# EAGLE design SmartTeaMachinePCB (EAGLE 9.6.2)
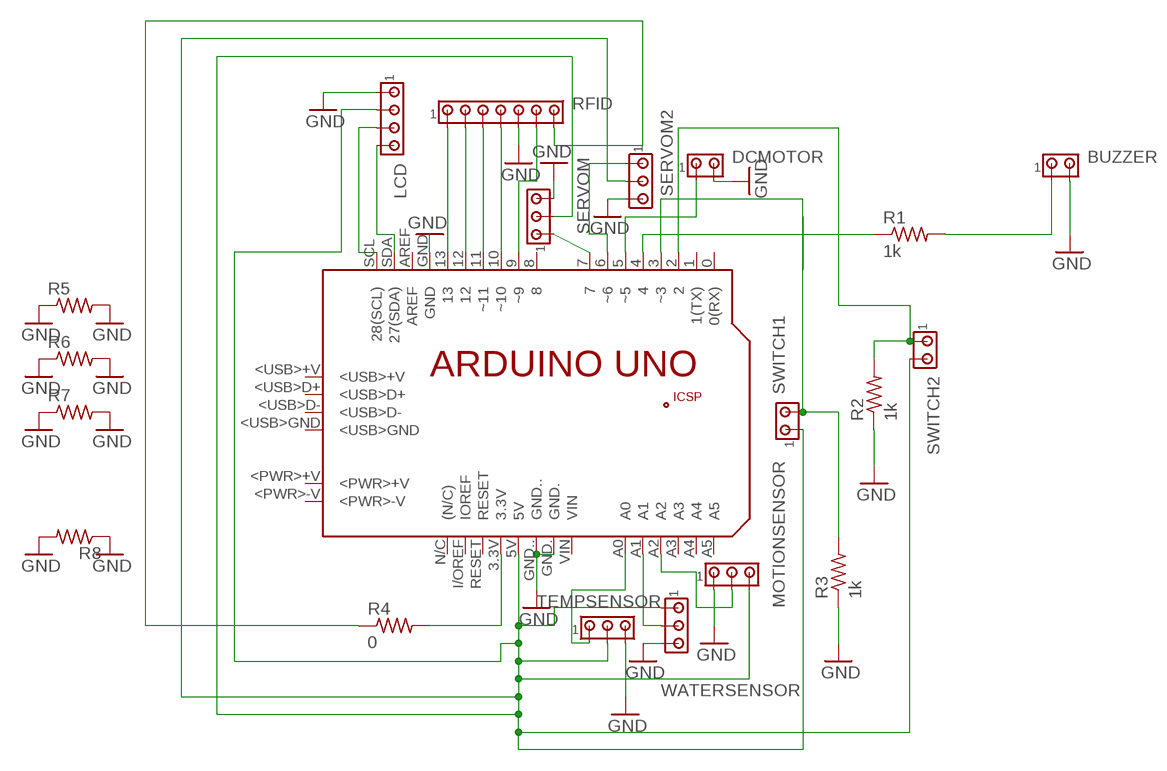
[diagram p0: schematic, sheet 1]

## Parts
BUZZER  MTA02-100  [10X02MTA]
DCMOTOR  MTA02-100  [10X02MTA]
LCD  MTA04-100  [10X04MTA]
MOTIONSENSOR  MTA03-100  [10X03MTA]
PCB1  ARDUINO_UNO  [ARDUINO_UNO]
R1  1k  R-US_0207/10  [0207/10]
R2  1k  R-US_0207/10  [0207/10]
R3  1k  R-US_0207/10  [0207/10]
R4  0  R-US_0207/10  [0207/10]
R5  R-US_0207/10  [0207/10]
R6  R-US_0207/10  [0207/10]
R7  R-US_0207/10  [0207/10]
R8  R-US_0207/10  [0207/10]
RFID  MTA07-100  [10X07MTA]
SERVOM  MTA03-100  [10X03MTA]
SERVOM2  MTA03-100  [10X03MTA]
SWITCH1  MTA02-100  [10X02MTA]
SWITCH2  MTA02-100  [10X02MTA]
TEMPSENSOR  MTA03-100  [10X03MTA]
WATERSENSOR  MTA03-100  [10X03MTA]

## Nets
GND: BUZZER.2 DCMOTOR.2 LCD.1 MOTIONSENSOR.1 PCB1.GND PCB1.GND. PCB1.GND.. R2.1 R3.1 R5.1 R5.2 R6.1 R6.2 R7.1 R7.2 R8.1 R8.2 RFID.5 SERVOM2.3 SERVOM.3 TEMPSENSOR.3 WATERSENSOR.3
N$1: PCB1.7 SERVOM.1
N$2: PCB1.6(~6) SERVOM2.1
N$3: PCB1.A1 WATERSENSOR.2
N$4: PCB1.A0 TEMPSENSOR.1
N$5: LCD.2 MOTIONSENSOR.3 PCB1.5V SERVOM2.2 SERVOM.2 SWITCH1.1 SWITCH2.2 TEMPSENSOR.2 WATERSENSOR.1
N$6: LCD.3 PCB1.SCL(28(SCL))
N$7: LCD.4 PCB1.SDA(27(SDA))
N$8: PCB1.13 RFID.1
N$9: PCB1.12 RFID.2
N$10: MOTIONSENSOR.2 PCB1.A2
N$11: PCB1.11(~11) RFID.3
N$12: PCB1.10(~10) RFID.4
N$13: PCB1.9(~9) RFID.6
N$14: R4.1 RFID.7
N$15: DCMOTOR.1 PCB1.5(~5)
N$16: PCB1.4 R1.1
N$17: BUZZER.1 R1.2
N$18: PCB1.2 R2.2 SWITCH2.1
N$19: PCB1.3.3V R4.2
N$23: PCB1.3(~3) R3.2 SWITCH1.2
Unconnected: PCB1.0(0(RX)) PCB1.1(1(TX)) PCB1.8 PCB1.+5V PCB1.<PWR>+V PCB1.<PWR>-V PCB1.<USB>+V PCB1.<USB>D+ PCB1.<USB>D- PCB1.<USB>GND PCB1.A3 PCB1.A4 PCB1.A5 PCB1.AREF PCB1.GND_ PCB1.I/OREF(IOREF) PCB1.MISO PCB1.MOSI PCB1.N/C((N/C)) PCB1.RESET PCB1.RESET. PCB1.SCK PCB1.VIN

## Library data of the parts
BUZZER DCMOTOR SWITCH1 SWITCH2 = con-amp:MTA02-100: AMP connector
LCD = con-amp:MTA04-100: AMP connector
MOTIONSENSOR SERVOM SERVOM2 TEMPSENSOR WATERSENSOR = con-amp:MTA03-100: AMP connector
PCB1 = Arduino_Shield (1):ARDUINO_UNO: Device for representing an Arduino Uno board with a footprint in an EAGLE design. Created by Dave Young for Element14. More EAGLE documentation at: http://www.element14.com/community/community/knode/cadsoft_eagle
R1-R8 = rcl:R-US_: RESISTOR, American symbol; SPICEPREFIX: R
RFID = con-amp:MTA07-100: AMP connector

## Board
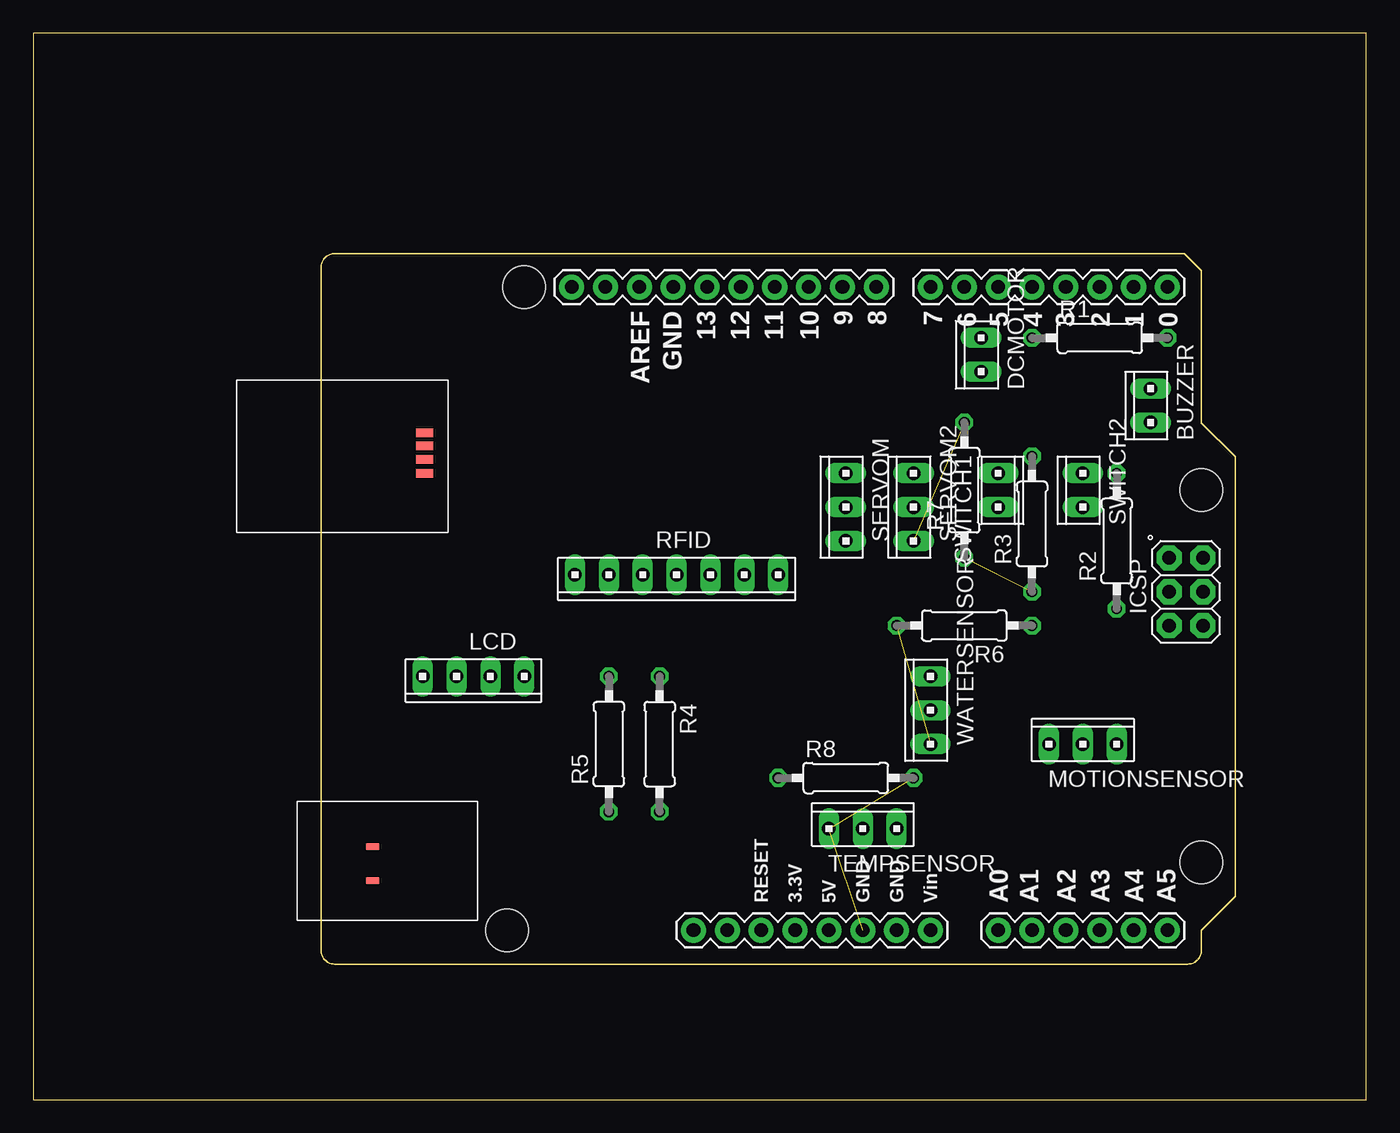
[diagram p1: board, top side]
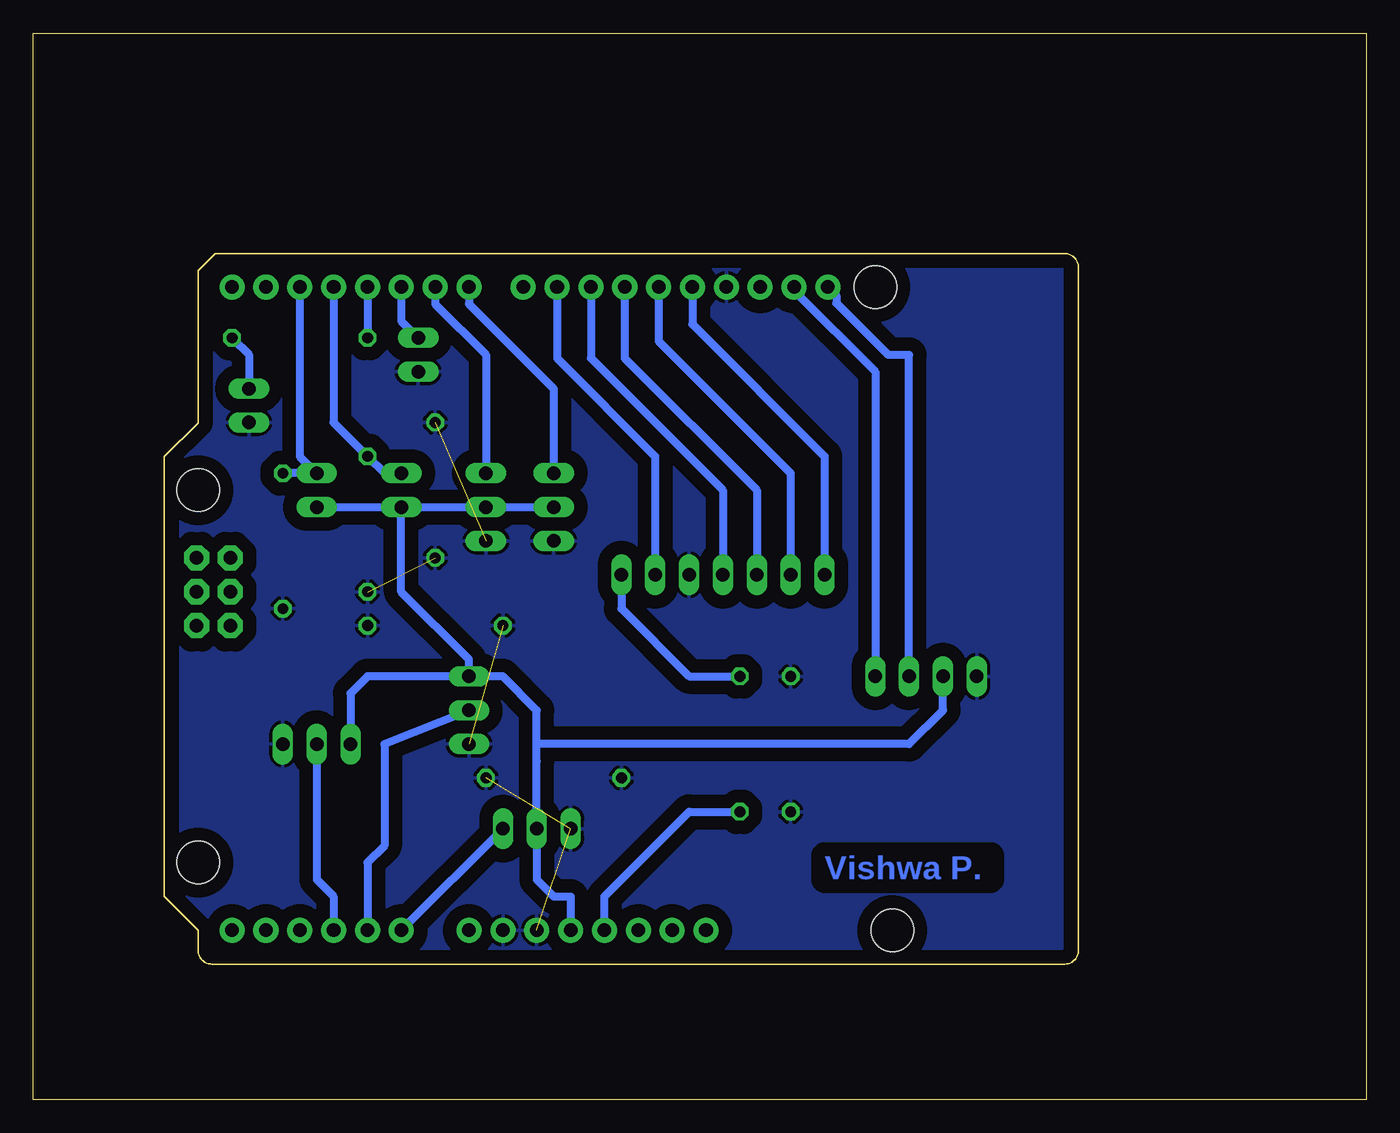
[diagram p2: board, bottom side, seen from below]

Size 100 x 80 mm. Coordinates in mm from the lower left corner, seen from the top.
Outline: 0,0 100,0 100,80 0,80 0,0
Copper layers (1*16): Top 0.035mm / dielectric 1.5mm / Bottom 0.035mm
Design rules "default *": minimum track width 6mil, minimum drill 0.35mm, track to track 12mil, track to pad 12mil, pad to pad 8mil, via to via 8mil, smd to smd 8mil, copper to edge 40mil, drill to drill 6mil, minimum pad ring 10mil, minimum via ring 8mil, stop-mask expansion 4mil, vias tented up to drill 0mil, thermal gap 10mil

### Footprints (pad centres in the part's own frame; a part is rotated, then mirrored left to right if it is on the bottom)
10X02MTA = drill 1.016 long: 1 1.27,0; 2 -1.27,0
10X04MTA = drill 1.016 long: 1 3.81,0; 2 1.27,0; 3 -1.27,0; 4 -3.81,0
10X03MTA = drill 1.016 long: 1 2.54,0; 2 0,0; 3 -2.54,0
ARDUINO_UNO = drill 1.016 pad 1.88: 0 63.5,50.8; 1 60.96,50.8; 2 58.42,50.8; 3 55.88,50.8; 3.3V 35.56,2.54; 4 53.34,50.8; 5 50.8,50.8; 5V 38.1,2.54; 6 48.26,50.8; 7 45.72,50.8; 8 41.656,50.8; 9 39.116,50.8; 10 36.576,50.8; 11 34.036,50.8; 12 31.496,50.8; 13 28.956,50.8; A0 50.8,2.54; A1 53.34,2.54; A2 55.88,2.54; A3 58.42,2.54; A4 60.96,2.54; A5 63.5,2.54; AREF 23.876,50.8; GND 26.416,50.8; GND. 43.18,2.54; GND.. 40.64,2.54; I/OREF 30.48,2.54; N/C 27.94,2.54; RESET 33.02,2.54; SCL 18.796,50.8; SDA 21.336,50.8; VIN 45.72,2.54 | drill 1.016 pad 1.88 octagon: +5V 66.167,30.48; GND_ 66.167,25.4; MISO 63.627,30.48; MOSI 66.167,27.94; RESET. 63.627,25.4; SCK 63.627,27.94 | smd 1.016 x 0.508: <PWR>+V 3.861,8.814; <PWR>-V 3.861,6.274 | smd 1.27 x 0.635: <USB>+V 7.772,39.878; <USB>D+ 7.772,38.887; <USB>D- 7.772,37.871; <USB>GND 7.772,36.83 | hole 3.2: 66.04,7.62; 66.04,35.56; 15.24,50.8; 13.97,2.54
0207/10 = drill 0.813 octagon: 1 -5.08,0; 2 5.08,0
10X07MTA = drill 1.016 long: 1 7.62,0; 2 5.08,0; 3 2.54,0; 4 0,0; 5 -2.54,0; 6 -5.08,0; 7 -7.62,0

### Placement (x,y rotation side)
BUZZER  83.82,52.07 90 top
DCMOTOR  71.12,55.88 90 top
LCD  33.02,31.75 180 top
MOTIONSENSOR  78.74,26.67 0 top
PCB1  21.59,10.16 0 top
R1  80.01,57.15 0 top
R2  81.28,41.91 90 top
R3  74.93,43.18 90 top
R4  46.99,26.67 270 top
R5  43.18,26.67 90 top
R6  69.85,35.56 180 top
R7  69.85,45.72 90 top
R8  60.96,24.13 0 top
RFID  48.26,39.37 180 top
SERVOM  60.96,44.45 90 top
SERVOM2  66.04,44.45 90 top
SWITCH1  72.39,45.72 270 top
SWITCH2  78.74,45.72 90 top
TEMPSENSOR  62.23,20.32 0 top
WATERSENSOR  67.31,29.21 90 top

### Tracks (layer width: path | path; a pad name or v marks a point on that pad's centre or on a via)
GND  (5 unrouted)
  pour Bottom (isolate 1.016): 19.05,64.77 19.05,10.16 21.59,7.62 86.36,7.62 92.71,13.97 92.71,60.96 88.9,64.77
N$1
  Bottom 0.61: PCB1.7 67.31,59.69 60.96,53.34 SERVOM.1
N$2
  Bottom 0.61: PCB1.6 69.85,59.69 66.04,55.88 SERVOM2.1
N$3
  Bottom 0.61: WATERSENSOR.2 73.66,26.67 73.66,19.05 74.93,17.78 PCB1.A1
N$4
  Bottom 0.61: TEMPSENSOR.1 PCB1.A0
N$5
  Bottom 0.61: SERVOM.2 SERVOM2.2 SWITCH1.1 | 62.23,26.67 62.23,25.4 TEMPSENSOR.2 62.23,16.51 60.96,15.24 59.69,15.24 PCB1.5V | 62.23,26.67 62.23,29.21 64.77,31.75 WATERSENSOR.1 | 62.23,26.67 34.29,26.67 31.75,29.21 LCD.2 | SWITCH2.2 SWITCH1.1 | WATERSENSOR.1 74.93,31.75 76.2,30.48 MOTIONSENSOR.3 | WATERSENSOR.1 67.31,33.02 72.39,38.1 SWITCH1.1
N$6
  Bottom 0.61: LCD.3 34.29,55.88 35.88,55.88 39.75,59.75 39.75,60.33 PCB1.SCL
N$7
  Bottom 0.61: PCB1.SDA 42.93,60.71 36.83,54.61 LCD.4
N$8
  Bottom 0.61: PCB1.13 50.55,58.17 40.64,48.26 RFID.1
N$9
  Bottom 0.61: PCB1.12 53.09,56.9 43.18,46.99 RFID.2
N$10
  Bottom 0.61: MOTIONSENSOR.2 78.74,16.51 77.47,15.24 PCB1.A2
N$11
  Bottom 0.61: PCB1.11 55.63,55.63 45.72,45.72 RFID.3
N$12
  Bottom 0.61: PCB1.10 58.17,55.63 48.26,45.72 RFID.4
N$13
  Bottom 0.61: PCB1.9 60.71,55.63 53.34,48.26 RFID.6
N$14
  Bottom 0.61: RFID.7 55.88,36.83 50.8,31.75 R4.1
N$15
  Bottom 0.61: PCB1.5 72.39,58.42 DCMOTOR.1
N$16
  Bottom 0.61: PCB1.4 R1.1
N$17
  Bottom 0.61: R1.2 83.82,55.88 BUZZER.1
N$18
  Bottom 0.61: R2.2 SWITCH2.1 80.01,48.26 PCB1.2
N$19
  Bottom 0.61: PCB1.3.3V 57.15,15.24 50.8,21.59 R4.2
N$23
  Bottom 0.61: PCB1.3 77.47,50.8 R3.2 73.66,46.99 SWITCH1.2

### Text on the board
Bottom: Vishwa P.